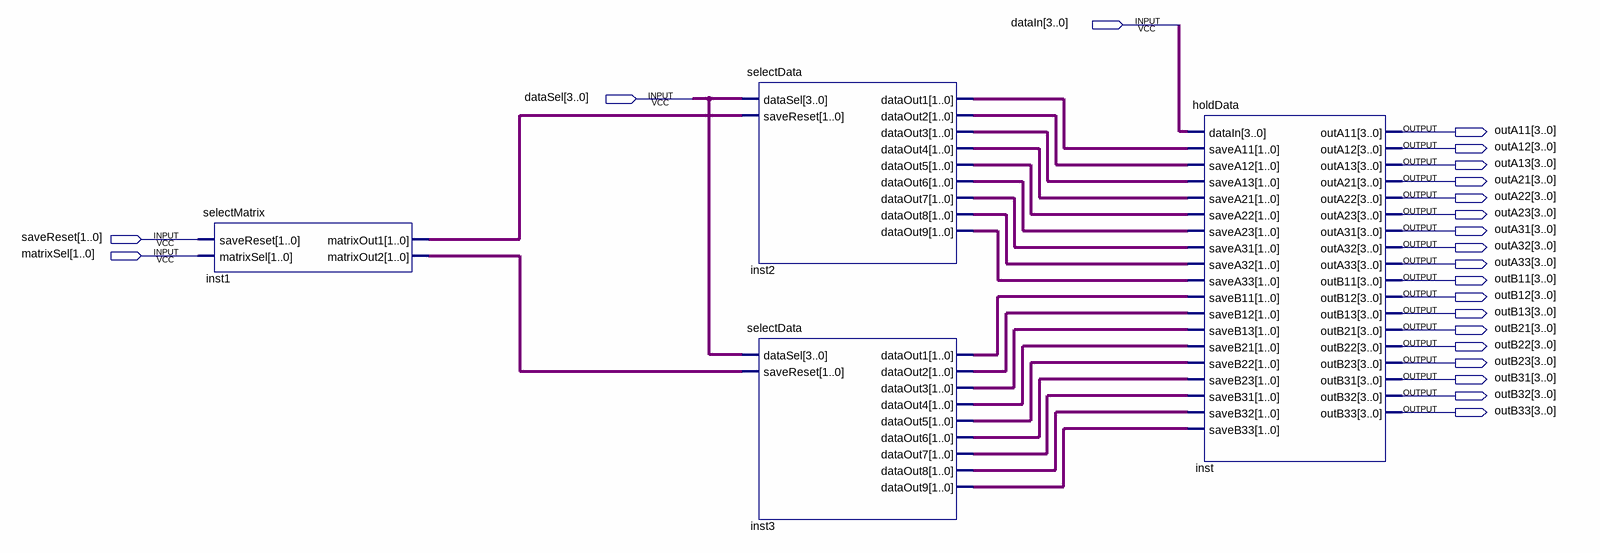
[diagram p0: schematic sheet]
// Quartus schematic Entrada.bdf as structural Verilog: 4 symbols, 22 pins
module Entrada (
  input  [3:0] dataIn,
  input  [3:0] dataSel,
  input  [1:0] saveReset,
  input  [1:0] matrixSel,
  output [3:0] outA11,
  output [3:0] outA12,
  output [3:0] outA13,
  output [3:0] outA21,
  output [3:0] outA22,
  output [3:0] outA23,
  output [3:0] outA31,
  output [3:0] outA32,
  output [3:0] outA33,
  output [3:0] outB11,
  output [3:0] outB12,
  output [3:0] outB13,
  output [3:0] outB21,
  output [3:0] outB22,
  output [3:0] outB23,
  output [3:0] outB31,
  output [3:0] outB32,
  output [3:0] outB33
);

  wire [1:0] inst1_matrixout1, inst1_matrixout2, inst2_dataout1, inst2_dataout2, inst2_dataout3,
       inst2_dataout4, inst2_dataout5, inst2_dataout6, inst2_dataout7, inst2_dataout8, inst2_dataout9,
       inst3_dataout1, inst3_dataout2, inst3_dataout3, inst3_dataout4, inst3_dataout5, inst3_dataout6,
       inst3_dataout7, inst3_dataout8, inst3_dataout9;

  selectMatrix inst1 (
    .saveReset(saveReset), .matrixSel(matrixSel), .matrixOut1(inst1_matrixout1), .matrixOut2(inst1_matrixout2));
  selectData inst2 (
    .dataSel(dataSel), .saveReset(inst1_matrixout1), .dataOut1(inst2_dataout1), .dataOut2(inst2_dataout2),
    .dataOut3(inst2_dataout3), .dataOut4(inst2_dataout4), .dataOut5(inst2_dataout5),
    .dataOut6(inst2_dataout6), .dataOut7(inst2_dataout7), .dataOut8(inst2_dataout8), .dataOut9(inst2_dataout9));
  selectData inst3 (
    .dataSel(dataSel), .saveReset(inst1_matrixout2), .dataOut1(inst3_dataout1), .dataOut2(inst3_dataout2),
    .dataOut3(inst3_dataout3), .dataOut4(inst3_dataout4), .dataOut5(inst3_dataout5),
    .dataOut6(inst3_dataout6), .dataOut7(inst3_dataout7), .dataOut8(inst3_dataout8), .dataOut9(inst3_dataout9));
  holdData inst (
    .dataIn(dataIn), .saveA11(inst2_dataout1), .saveA12(inst2_dataout2), .saveA13(inst2_dataout3),
    .saveA21(inst2_dataout4), .saveA22(inst2_dataout5), .saveA23(inst2_dataout6), .saveA31(inst2_dataout7),
    .saveA32(inst2_dataout8), .saveA33(inst2_dataout9), .saveB11(inst3_dataout1), .saveB12(inst3_dataout2),
    .saveB13(inst3_dataout3), .saveB21(inst3_dataout4), .saveB22(inst3_dataout5), .saveB23(inst3_dataout6),
    .saveB31(inst3_dataout7), .saveB32(inst3_dataout8), .saveB33(inst3_dataout9), .outA11(outA11),
    .outA12(outA12), .outA13(outA13), .outA21(outA21), .outA22(outA22), .outA23(outA23), .outA31(outA31),
    .outA32(outA32), .outA33(outA33), .outB11(outB11), .outB12(outB12), .outB13(outB13), .outB21(outB21),
    .outB22(outB22), .outB23(outB23), .outB31(outB31), .outB32(outB32), .outB33(outB33));
endmodule
